# Altium schematic sheet Connector_circuit.SchDoc: Printer
size 431 x 279 mm; Date: 2022; Author: Renaissance; CompanyName: Upenn-ESE516; DrawnBy: Xinyang Tan;  Yuxin Wang; Engineer: Xinyang Tan;  Yuxin Wang; Address1: 200 S 33 St; Address2: Moore Building, Rm 101; Address3: Philadephla, PA 19104; DocumentNumber: 5; Revision: 1,0; SheetNumber: 5; SheetTotal: 9
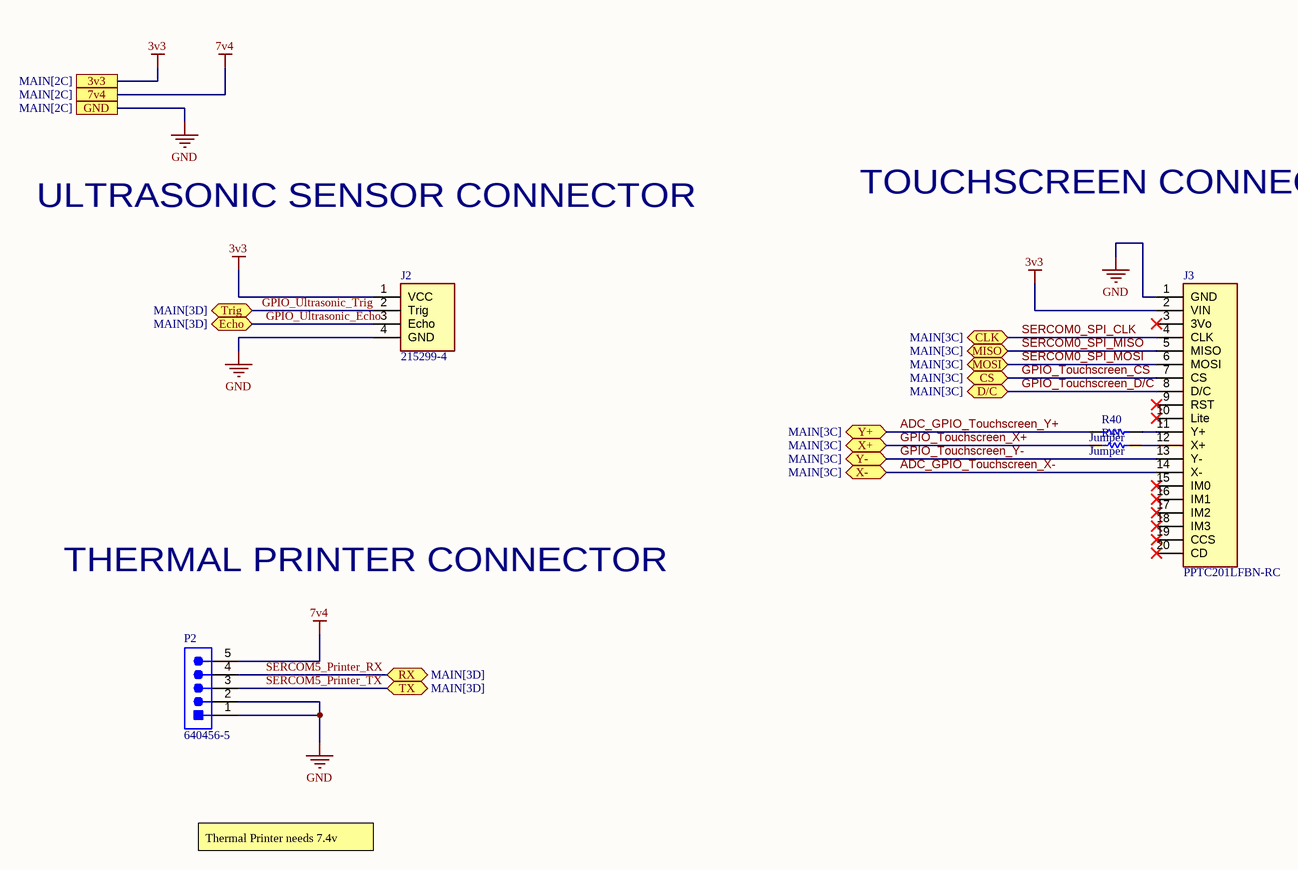
[diagram p0: Connector_circuit.SchDoc]

## Parts
J2  215299-4  [TE_215299-4]
J3  PPTC201LFBN-RC  [RHDR20W75P0X254_1X20_5130X254X850P]
P2  640456-5  [TECO-640456-5]
R40  Jumper  [RESC1609X50X30LL10T20]  (no BOM)
R41  Jumper  [RESC1609X50X30LL10T20]  (no BOM)

## Ports
3v3 (see MAIN[2C]), 7v4 (see MAIN[2C]), CLK (bidir, see MAIN[3C]), CS (bidir, see MAIN[3C]), D/C (bidir, see MAIN[3C]), Echo (bidir, see MAIN[3D]), GND (see MAIN[2C]), MISO (bidir, see MAIN[3C]), MOSI (bidir, see MAIN[3C]), RX (bidir, see MAIN[3D]), Trig (bidir, see MAIN[3D]), TX (bidir, see MAIN[3D]), X+ (bidir, see MAIN[3C]), X- (bidir, see MAIN[3C]), Y+ (bidir, see MAIN[3C]), Y- (bidir, see MAIN[3C])

## Nets
3v3: J2.1(VCC) J3.2(VIN) ; port 3v3
7v4: P2.5(CTS) ; port 7v4
GND: J2.4(GND) J3.1(GND) P2.1(DTR) P2.2(RXI) ; port GND
ADC_GPIO_Touchscreen_X-: J3.14(X-) ; port X-
ADC_GPIO_Touchscreen_Y+: R40.1 ; port Y+
GPIO_Touchscreen_CS: J3.7(CS) ; port CS
GPIO_Touchscreen_D/C: J3.8(D/C) ; port D/C
GPIO_Touchscreen_X+: R41.1 ; port X+
GPIO_Touchscreen_Y-: J3.13(Y-) ; port Y-
GPIO_Ultrasonic_Echo: J2.3(Echo) ; port Echo
GPIO_Ultrasonic_Trig: J2.2(Trig) ; port Trig
SERCOM0_SPI_CLK: J3.4(CLK) ; port CLK
SERCOM0_SPI_MISO: J3.5(MISO) ; port MISO
SERCOM0_SPI_MOSI: J3.6(MOSI) ; port MOSI
SERCOM5_Printer_RX: P2.4(VCC) ; port RX
SERCOM5_Printer_TX: P2.3(TXO) ; port TX
NetJ3_11: J3.11(Y+) R40.2
NetJ3_12: J3.12(X+) R41.2

Not connected (* = marked no-connect by the designer): J3 3(3Vo)* 9(RST)* 10(Lite)* 15(IM0)* 16(IM1)* 17(IM2)* 18(IM3)* 19(CCS)* 20(CD)*

## Notes on the sheet
- ULTRASONIC SENSOR CONNECTOR
- TOUCHSCREEN CONNECTOR
- THERMAL PRINTER CONNECTOR
- Thermal Printer needs 7.4v
- DWG. NO.
- REV.
- SHT.
- THIS DOCUMENT AND THE DATA DISCLOSED HEREIN OR HEREWITH IS THE PROPERTY OF ALTIUM LIMITED AND MAY BE FREELY DISTRIBUTED IN WHOLE. NO RIGHTS ARE RESERVED OR EXPRESS OR IMPLIED WARANTEE GIVEN.
- REVISION
- DESCRIPTION
- DATE
- APPROVED
- ENG:
- APPROVALS
- PROJECT
- DSN:
- CHK:
- REFERENCE DOCUMENTS
- PROJECT REVISION:
- TITLE
- DOCUMENT REVISION:
- DESIGN ITEM:
- BOM:
- FAB DWG:
- PCB DWG:
- ASSY DWG:
- SCALE:
- SIZE
- B
- CAGE CODE
- FILE NAME
- DWG NO.
- SHEET
- OF
- REV

## Library data of the parts
J2 = 215299-4: Connector; Package: None; Price: None; Value: *; MP: 215299-4; Availability: Unavailable
J3 = PPTC201LFBN-RC: Connector; Manufacturer_Name: Sullins; Datasheet Link: https://media.digikey.com/pdf/Data%20Sheets/Sullins%20PDFs/Female_Headers.100_DS.pdf; Height: 8.5mm; Manufacturer_Part_Number: PPTC201LFBN-RC
P2 = CMP-1684-00014-1: Male Header, Pitch 2.54 mm, 1 x 5 Position, Height 10.03 mm, Tail Length 3.56 mm, / -55 to 105 degC, RoHS, Bulk; Manufacturer: TE Connectivity; Material, Housing: Polyester; Brand/Series: MTA-100Series; Color, Housing: White; Current, Rating: 5 / A; Temperature, Operating: -55to+105 / °C; Connector Type: MTA-100; Agency Approvals: CSA,UL; Material, Contact: CopperAlloy; Mounting Hole Size: 0.04 / "; Voltage, Rating: 250 / V; Contact Termination Area Plating: Tin; Pin Spacing: 0.1 / "; Primary Type: InterconnectSystem; Special Features: Pinstrip; Mount Angle: Vertical; Contact Centerline Spacing: 0.100 / in.; Number of Contacts: 5; Standards: RoHSCompliant,ELVCompliant,UL94V-0; Angle: Straight; Length, Terminal Post: 0.14 / in.; Manufacturer URL: http://www.te.com; Flammability Rating: UL94V-0; Mounting Type: PCMount; Termination: Solder; Package Reference: THD; Length, Overall: 0.5 / "; Contact Mating Area Plating: Tin; Length, Pin: 0.14 / "; Datasheet URL: http://sigma.octopart.com/77881742/technical_drawing/TE-Connectivity-640456-5.pdf; Package Description: Male Header, Pitch 2.54 mm, 1 x 5 Position, Height 10.03 mm, Tail Length 3.56 mm; Datasheet Version: Rev. W3; Contact Plating: Tin; Color: White; Number of Positions: 5; Type: PCBPlug; Contact Shape: Square; Number of Rows: 1; Size, Post: 0.025 / in.
R40 R41 = CMP-1012-00001-2: Manufacturer: Vishay Dale; Part Number: CRCW06030000Z0EC